# EAGLE design KGM IOExpander v1.1 (EAGLE 5.11)
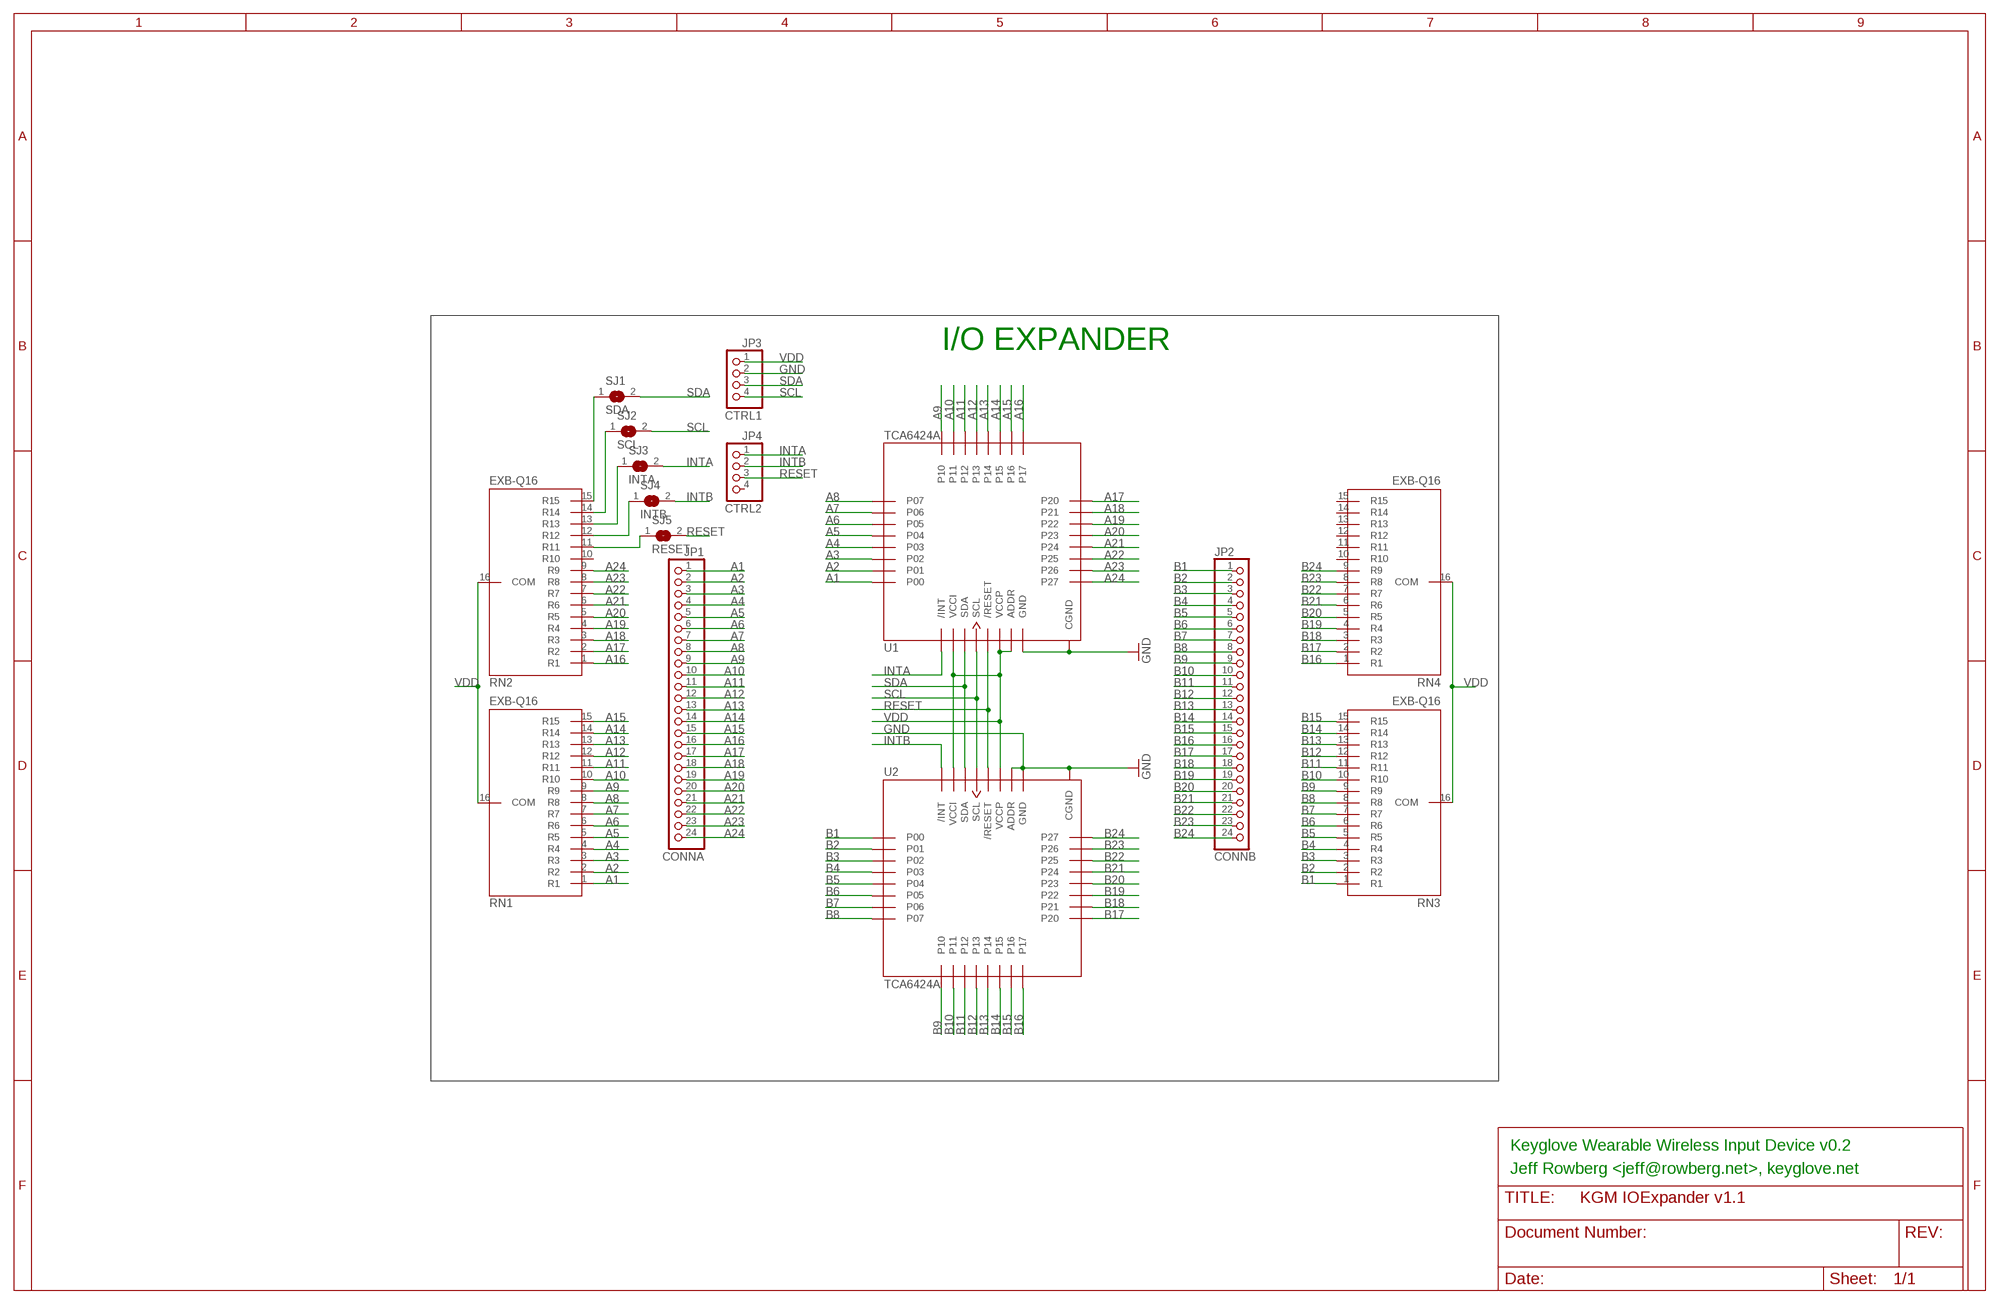
[diagram p0: schematic, sheet 1]

## Parts
JP1  CONNA  PINHD-1X24  [1X24]
JP2  CONNB  PINHD-1X24  [1X24]
JP3  CTRL1  PINHD-1X4  [1X04]
JP4  CTRL2  PINHD-1X4  [1X04]
RN1  EXB-Q16  [SMD1506]
RN2  EXB-Q16  [SMD1506]
RN3  EXB-Q16  [SMD1506]
RN4  EXB-Q16  [SMD1506]
SJ1  SDA  SJ  [SJ]
SJ2  SCL  SJ  [SJ]
SJ3  INTA  SJ  [SJ]
SJ4  INTB  SJ  [SJ]
SJ5  RESET  SJ  [SJ]
U1  TCA6424A  [QFN32]
U2  TCA6424A  [QFN32]

## Nets
A1: JP1.1 RN1.1(R1) U1.1(P00)
A2: JP1.2 RN1.2(R2) U1.2(P01)
A3: JP1.3 RN1.3(R3) U1.3(P02)
A4: JP1.4 RN1.4(R4) U1.4(P03)
A5: JP1.5 RN1.5(R5) U1.5(P04)
A6: JP1.6 RN1.6(R6) U1.6(P05)
A7: JP1.7 RN1.7(R7) U1.7(P06)
A8: JP1.8 RN1.8(R8) U1.8(P07)
A9: JP1.9 RN1.9(R9) U1.9(P10)
A10: JP1.10 RN1.10(R10) U1.10(P11)
A11: JP1.11 RN1.11(R11) U1.11(P12)
A12: JP1.12 RN1.12(R12) U1.12(P13)
A13: JP1.13 RN1.13(R13) U1.13(P14)
A14: JP1.14 RN1.14(R14) U1.14(P15)
A15: JP1.15 RN1.15(R15) U1.15(P16)
A16: JP1.16 RN2.1(R1) U1.16(P17)
A17: JP1.17 RN2.2(R2) U1.17(P20)
A18: JP1.18 RN2.3(R3) U1.18(P21)
A19: JP1.19 RN2.4(R4) U1.19(P22)
A20: JP1.20 RN2.5(R5) U1.20(P23)
A21: JP1.21 RN2.6(R6) U1.21(P24)
A22: JP1.22 RN2.7(R7) U1.22(P25)
A23: JP1.23 RN2.8(R8) U1.23(P26)
A24: JP1.24 RN2.9(R9) U1.24(P27)
B1: JP2.1 RN3.1(R1) U2.1(P00)
B2: JP2.2 RN3.2(R2) U2.2(P01)
B3: JP2.3 RN3.3(R3) U2.3(P02)
B4: JP2.4 RN3.4(R4) U2.4(P03)
B5: JP2.5 RN3.5(R5) U2.5(P04)
B6: JP2.6 RN3.6(R6) U2.6(P05)
B7: JP2.7 RN3.7(R7) U2.7(P06)
B8: JP2.8 RN3.8(R8) U2.8(P07)
B9: JP2.9 RN3.9(R9) U2.9(P10)
B10: JP2.10 RN3.10(R10) U2.10(P11)
B11: JP2.11 RN3.11(R11) U2.11(P12)
B12: JP2.12 RN3.12(R12) U2.12(P13)
B13: JP2.13 RN3.13(R13) U2.13(P14)
B14: JP2.14 RN3.14(R14) U2.14(P15)
B15: JP2.15 RN3.15(R15) U2.15(P16)
B16: JP2.16 RN4.1(R1) U2.16(P17)
B17: JP2.17 RN4.2(R2) U2.17(P20)
B18: JP2.18 RN4.3(R3) U2.18(P21)
B19: JP2.19 RN4.4(R4) U2.19(P22)
B20: JP2.20 RN4.5(R5) U2.20(P23)
B21: JP2.21 RN4.6(R6) U2.21(P24)
B22: JP2.22 RN4.7(R7) U2.22(P25)
B23: JP2.23 RN4.8(R8) U2.23(P26)
B24: JP2.24 RN4.9(R9) U2.24(P27)
GND [power]: JP3.2 U1.25(GND) U1.EP(CGND) U2.25(GND) U2.26(ADDR) U2.EP(CGND)
INTA: JP4.1 SJ3.2 U1.32(/INT)
INTB: JP4.2 SJ4.2 U2.32(/INT)
N$1: RN2.15(R15) SJ1.1
N$2: RN2.14(R14) SJ2.1
N$3: RN2.13(R13) SJ3.1
N$4: RN2.12(R12) SJ4.1
N$5: RN2.11(R11) SJ5.1
RESET: JP4.3 SJ5.2 U1.28(/RESET) U2.28(/RESET)
SCL: JP3.4 SJ2.2 U1.29(SCL) U2.29(SCL)
SDA: JP3.3 SJ1.2 U1.30(SDA) U2.30(SDA)
VDD [power]: JP3.1 RN1.16(COM) RN2.16(COM) RN3.16(COM) RN4.16(COM) U1.26(ADDR) U1.27(VCCP) U1.31(VCCI) U2.27(VCCP) U2.31(VCCI)
Unconnected: JP4.4 RN2.10(R10) RN4.10(R10) RN4.11(R11) RN4.12(R12) RN4.13(R13) RN4.14(R14) RN4.15(R15)

## Notes on the sheet
- I/O EXPANDER
- Keyglove Wearable Wireless Input Device v0.2
- Jeff Rowberg <jeff@rowberg.net>, keyglove.net

## Library data of the parts
JP1 JP2 = sf-pinhead:PINHD-1X24: PIN HEADER
JP3 JP4 = sf-pinhead:PINHD-1X4: PIN HEADER
RN1-RN4 = sf-keyglove:EXB-Q16
SJ1-SJ5 = jumper:SJ: SMD solder JUMPER
U1 U2 = sf-keyglove:TCA6424A

## Net classes
0 default: width 0.152 mm, drill 0.305 mm, clearance 0.152 mm
1 power: width 0.254 mm, drill 0.305 mm, clearance 0.152 mm

## Board
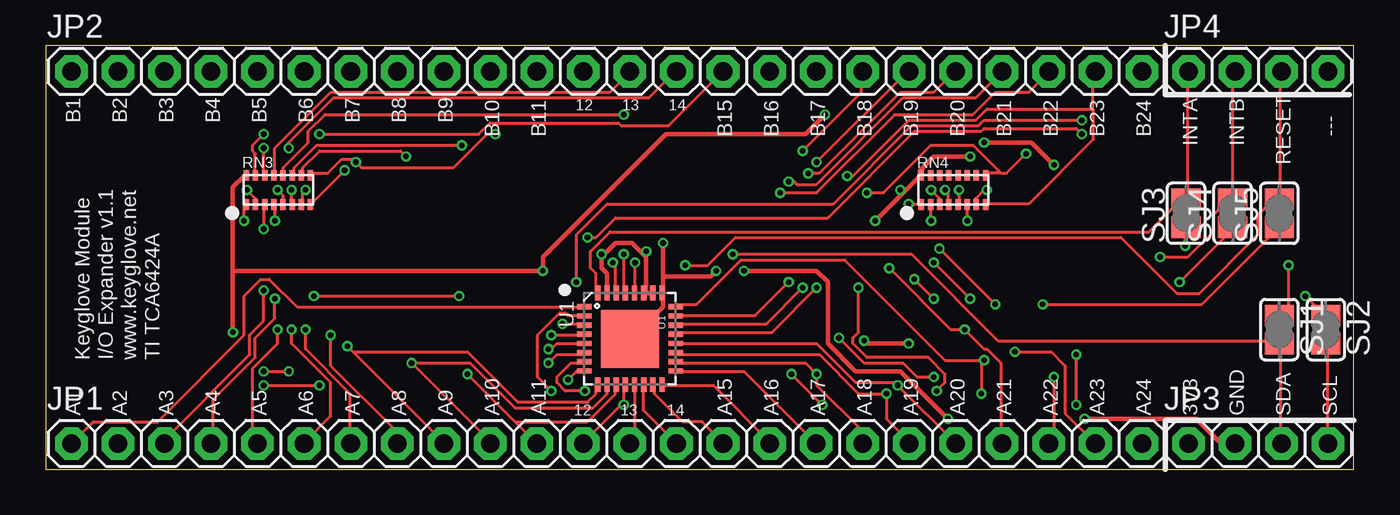
[diagram p1: board, top side]
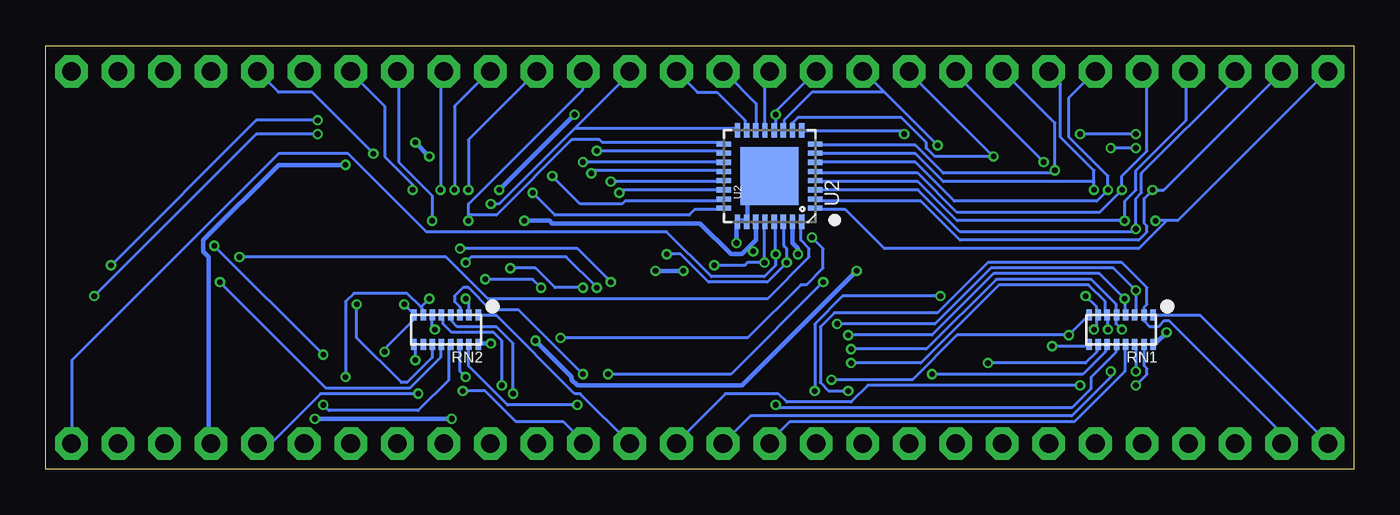
[diagram p2: board, bottom side, seen from below]

Size 71.37 x 23.11 mm. Coordinates in mm from the lower left corner, seen from the top.
Outline: 0,0 71.37,0 71.37,23.11 0,23.11 0,0
Copper layers (1*16): Top 0.0356mm / dielectric 1.5011mm / Bottom 0.0356mm
Design rules "PCBWingOrder *": minimum track width 6mil, minimum drill 12mil, track to track 6mil, track to pad 6mil, pad to pad 6mil, via to via 6mil, smd to smd 6mil, copper to edge 15mil, drill to drill 6mil, minimum pad ring 6mil, minimum via ring 5mil, stop-mask expansion 4mil, vias tented up to drill 20mil, thermal gap 10mil

### Footprints (pad centres in the part's own frame; a part is rotated, then mirrored left to right if it is on the bottom)
1X24 = drill 1.016 pad 1.778 octagon: 1 -29.21,0; 2 -26.67,0; 3 -24.13,0; 4 -21.59,0; 5 -19.05,0; 6 -16.51,0; 7 -13.97,0; 8 -11.43,0; 9 -8.89,0; 10 -6.35,0; 11 -3.81,0; 12 -1.27,0; 13 1.27,0; 14 3.81,0; 15 6.35,0; 16 8.89,0; 17 11.43,0; 18 13.97,0; 19 16.51,0; 20 19.05,0; 21 21.59,0; 22 24.13,0; 23 26.67,0; 24 29.21,0
1X04 = drill 1.016 pad 1.778 octagon: 1 -3.81,0; 2 -1.27,0; 3 1.27,0; 4 3.81,0
SMD1506 = smd 0.3 x 0.6: 1 -1.75,-0.8; 2 -1.25,-0.8; 3 -0.75,-0.8; 4 -0.25,-0.8; 5 0.25,-0.8; 6 0.75,-0.8; 7 1.25,-0.8; 8 1.75,-0.8; 9 1.75,0.8; 10 1.25,0.8; 11 0.75,0.8; 12 0.25,0.8; 13 -0.25,0.8; 14 -0.75,0.8; 15 -1.25,0.8; 16 -1.75,0.8
SJ = smd 1.168 x 1.6: 1 -0.762,0; 2 0.762,0
QFN32 = smd 0.285 x 0.8: 1 -1.75,-2.5; 2 -1.25,-2.5; 3 -0.75,-2.5; 4 -0.25,-2.5; 5 0.25,-2.5; 6 0.75,-2.5; 7 1.25,-2.5; 8 1.75,-2.5; 17 1.75,2.5; 18 1.25,2.5; 19 0.75,2.5; 20 0.25,2.5; 21 -0.25,2.5; 22 -0.75,2.5; 23 -1.25,2.5; 24 -1.75,2.5 | smd 0.8 x 0.285: 9 2.5,-1.75; 10 2.5,-1.25; 11 2.5,-0.75; 12 2.5,-0.25; 13 2.5,0.25; 14 2.5,0.75; 15 2.5,1.25; 16 2.5,1.75; 25 -2.5,1.75; 26 -2.5,1.25; 27 -2.5,0.75; 28 -2.5,0.25; 29 -2.5,-0.25; 30 -2.5,-0.75; 31 -2.5,-1.25; 32 -2.5,-1.75 | smd 3.15 x 3.15: EP 0,0

### Placement (x,y rotation side)
JP1  30.61,1.4 0 top
JP2  30.61,21.72 0 top
JP3  66.17,1.4 0 top
JP4  66.17,21.72 0 top
RN1  12.7,7.62 180 bottom
RN2  49.53,7.62 180 bottom
RN3  12.7,15.24 0 top
RN4  49.53,15.24 0 top
SJ1  67.31,7.62 270 top
SJ2  69.85,7.62 270 top
SJ3  62.23,13.97 90 top
SJ4  64.77,13.97 90 top
SJ5  67.31,13.97 90 top
U1  31.88,7.11 270 top
U2  31.88,16 90 bottom

### Tracks (layer width: path | path; a pad name or v marks a point on that pad's centre or on a via)
A1
  Top 0.152: U1.1 29.26,8.84 13.72,8.84 12.19,10.36 11.73,10.36 10.82,9.45 10.82,7.32 6.1,2.59 2.59,2.59 JP1.1
  Bottom 0.152: RN1.1 10.82,8.38 8.38,8.38 JP1.1
A2  (via drill 0.3)
  Top 0.152: v27.58,4.27 26.82,5.03 26.82,7.32 28.04,8.53 28.35,8.53 28.5,8.38 29.26,8.38 U1.2
  Bottom 0.152: JP1.2 3.96,1.52 3.96,1.98 10.06,8.08 10.36,8.08 10.67,7.77 11.12,7.77 11.43,8.08 11.43,8.38 RN1.2 11.43,8.53 11.43,8.84 11.28,8.99 11.28,9.91 12.65,11.28 19.96,11.28 22.71,8.53 28.35,8.53 29.11,7.77 29.11,4.72 28.65,4.27 v27.58,4.27
A3  (via drill 0.3)
  Top 0.152: v11.89,9.75 11.89,8.08 11.12,7.32 11.12,6.25 6.4,1.52 JP1.3 | v28.19,7.92 29.26,7.92 U1.3
  Bottom 0.152: RN1.3 11.89,8.53 v11.89,9.75 13.11,10.97 19.81,10.97 22.86,7.92 v28.19,7.92
A4  (via drill 0.3)
  Top 0.152: v12.5,9.3 12.5,8.23 11.43,7.16 11.43,6.1 9.14,3.81 9.14,1.52 JP1.4 | v27.58,7.32 29.26,7.32 U1.4
  Bottom 0.152: RN1.4 12.5,8.53 v12.5,9.3 13.87,10.67 19.66,10.67 23.01,7.32 v27.58,7.32
A5  (via drill 0.3)
  Top 0.152: v12.65,7.62 12.65,6.86 11.28,5.49 11.28,1.68 JP1.5 | v27.43,6.55 27.58,6.55 27.89,6.86 29.26,6.86 U1.5
  Bottom 0.152: v12.65,7.62 12.95,7.92 12.95,8.38 RN1.5 12.95,8.53 12.95,8.99 14.33,10.36 19.51,10.36 23.32,6.55 v27.43,6.55
A6  (via drill 0.3)
  Top 0.152: v13.41,7.62 13.41,6.86 15.54,4.72 15.54,2.9 14.17,1.52 JP1.6 | v27.43,5.79 27.89,6.25 29.26,6.25 U1.6
  Bottom 0.152: v13.41,7.62 13.41,8.38 RN1.6 13.56,8.53 13.56,9.14 14.48,10.06 19.36,10.06 23.62,5.79 v27.43,5.79
A7  (via drill 0.3)
  Top 0.152: v14.17,7.62 14.17,6.55 16.61,4.12 16.61,1.52 JP1.7 | v29.41,4.27 28.35,4.27 27.89,4.72 27.89,5.03 28.65,5.79 29.26,5.79 U1.7 | v14.63,9.45 v22.55,9.45
  Bottom 0.152: v14.17,7.62 14.02,7.77 14.02,8.38 RN1.7 14.02,8.53 14.02,8.84 v14.63,9.45 | v29.41,4.27 29.41,7.92 27.89,9.45 v22.55,9.45
A8  (via drill 0.3)
  Top 0.152: v15.54,7.32 15.54,5.64 19.05,2.13 19.05,1.52 JP1.8 | v28.5,4.88 28.96,5.33 29.26,5.33 U1.8
  Bottom 0.152: RN1.8 14.48,8.38 v15.54,7.32 21.64,7.32 24.08,4.88 v28.5,4.88
A9  (via drill 0.3)
  Top 0.152: 16.76,6.4 21.64,1.52 JP1.9 | v16.46,6.71 16.76,6.4 | 16.76,6.4 23.01,6.4 25.76,3.66 29.57,3.66 30.02,4.12 30.02,4.57 U1.9
  Bottom 0.152: v16.46,6.71 14.48,6.71 RN1.9
A10  (via drill 0.3)
  Top 0.152: JP1.10 24.23,1.52 v19.96,5.79 23.16,5.79 25.6,3.35 29.87,3.35 30.63,4.12 30.63,4.57 U1.10
  Bottom 0.152: v19.96,5.79 14.63,5.79 14.02,6.4 14.02,6.71 RN1.10
A11  (via drill 0.3)
  Top 0.152: v23.01,5.18 25.6,2.59 | 25.6,2.59 JP1.11 | 25.6,2.59 29.57,2.59 31.09,4.12 31.09,4.57 U1.11
  Bottom 0.152: v23.01,5.18 14.78,5.18 13.56,6.4 13.56,6.71 RN1.11
A12  (via drill 0.3)
  Top 0.152: 31.55,3.66 31.55,4.57 U1.12 | 31.55,3.66 29.41,1.52 JP1.12 | v31.55,3.5 31.55,3.66
  Bottom 0.152: v31.55,3.5 31.39,3.35 15.39,3.35 14.33,4.42 14.33,5.03 12.95,6.4 12.95,6.71 RN1.12
A13
  Top 0.152: U1.13 32.16,4.57 32.16,1.68 JP1.13
  Bottom 0.152: RN1.13 12.5,6.71 12.5,5.33 15.24,2.59 30.79,2.59 31.85,1.52 JP1.13
A14  (via drill 0.3)
  Top 0.152: v11.89,5.33 v13.26,5.33 | U1.14 32.61,4.57 32.61,3.2 JP1.14
  Bottom 0.152: v11.89,5.33 11.89,6.71 RN1.14 | v13.26,5.33 13.26,5.03 15.39,2.9 32.92,2.9 JP1.14
A15  (via drill 0.3)
  Top 0.152: v11.89,4.57 v14.94,4.57 | U1.15 33.22,4.57 33.22,4.12 34.75,2.59 35.81,2.59 36.88,1.52 JP1.15
  Bottom 0.152: v11.89,4.57 11.28,5.18 11.28,5.49 11.43,5.64 11.43,6.71 RN1.15 | v14.94,4.57 26.52,4.57 27.43,3.66 30.94,3.66 31.39,4.12 34.29,4.12 36.88,1.52 JP1.15
A16
  Top 0.152: U1.16 33.68,4.57 36.42,4.57 39.47,1.52 JP1.16
  Bottom 0.152: RN2.1 47.7,8.38 46.79,8.38 42.52,4.12 42.22,4.12 JP1.16
A17  (via drill 0.3)
  Top 0.152: v47.4,10.36 v48.46,9.3 | v44.35,9.91 44.35,7.47 44.04,7.16 44.04,6.86 44.81,6.1 48.16,6.1 49.07,5.18 49.07,4.72 v48.62,4.27 | U1.17 34.44,5.33 38.1,5.33 JP1.17
  Bottom 0.152: v48.46,9.3 48.31,9.14 48.31,8.53 RN2.2 | v47.4,10.36 44.81,10.36 v44.35,9.91 | v48.62,4.27 47.4,4.27 45.72,2.59 43.13,2.59 42.06,1.52 JP1.17
A18  (via drill 0.3)
  Top 0.152: JP1.18 44.5,1.52 44.5,2.13 42.06,4.57 v42.06,5.18 41.45,5.79 34.44,5.79 U1.18
  Bottom 0.152: v42.06,5.18 45.57,8.69 47.09,8.69 48.31,9.91 48.62,9.91 49.07,9.45 49.07,9.14 48.77,8.84 48.77,8.53 RN2.3
A19  (via drill 0.3)
  Top 0.152: JP1.19 47.09,1.52 45.87,2.74 v45.87,4.12 44.35,4.12 42.22,6.25 34.44,6.25 U1.19
  Bottom 0.152: v45.87,4.12 45.87,6.86 46.79,7.77 48.92,7.77 49.23,8.08 49.23,8.38 RN2.4
A20  (via drill 0.3)
  Top 0.152: JP1.20 v46.48,4.57 46.33,4.72 44.2,4.72 42.06,6.86 34.44,6.86 U1.20
  Bottom 0.152: v46.48,4.57 46.48,7.01 46.94,7.47 49.23,7.47 49.68,7.92 49.68,8.38 RN2.5
A21  (via drill 0.3)
  Top 0.152: JP1.21 52.12,1.52 52.12,5.79 51.36,6.55 51.21,6.55 v50.14,7.62 49.38,7.62 v46.02,10.97 | v42.06,9.91 39.62,7.47 34.44,7.47 U1.21
  Bottom 0.152: v50.14,7.62 50.29,7.77 50.29,8.38 RN2.6 | v42.06,9.91 43.59,9.91 44.65,10.97 v46.02,10.97
A22  (via drill 0.3)
  Top 0.152: v55.02,5.03 55.02,1.68 JP1.22 | v41.3,9.91 39.32,7.92 34.44,7.92 U1.22 | v48.46,11.28 v50.44,9.3
  Bottom 0.152: 50.9,8.84 51.66,9.6 54.56,9.6 55.02,9.14 v55.02,5.03 | 50.9,8.84 50.75,8.69 50.75,8.53 RN2.7 | v41.3,9.91 42.98,11.58 48.16,11.58 v48.46,11.28 | v50.44,9.3 50.9,8.84
A23  (via drill 0.3)
  Top 0.152: v52.88,6.4 54.86,6.4 55.63,5.64 55.63,3.05 JP1.23 | v40.54,10.21 38.71,8.38 34.44,8.38 U1.23 | v48.77,12.04 v51.82,8.99
  Bottom 0.152: v52.88,6.4 52.88,6.55 51.36,8.08 51.36,8.38 RN2.8 51.36,8.53 v51.82,8.99 | v40.54,10.21 42.37,12.04 v48.77,12.04
A24  (via drill 0.3)
  Top 0.152: 51.05,5.94 49.07,5.94 43.59,11.43 37.95,11.43 35.51,8.99 34.44,8.99 U1.24 | 51.05,5.94 v51.05,4.12 | 51.05,5.94 v51.21,5.94
  Bottom 0.152: v51.21,5.94 51.21,6.71 RN2.9 | v51.05,4.12 56.39,4.12 58.98,1.52 59.74,1.52 JP1.24
B1  (via drill 0.3)
  Top 0.152: v10.82,13.56 10.82,14.33 RN3.1
  Bottom 0.152: 10.21,13.56 9.6,13.56 1.52,21.64 JP2.1 | 10.21,13.56 v10.82,13.56 | 10.21,13.56 11.73,12.04 25.6,12.04 27.74,14.17 29.26,14.17 U2.1
B2  (via drill 0.3)
  Top 0.152: v10.97,15.24 11.43,14.78 11.43,14.48 RN3.2
  Bottom 0.152: JP2.2 3.96,21.64 10.36,15.24 v10.97,15.24 11.43,14.78 11.43,13.41 11.28,13.26 11.28,12.95 11.73,12.5 21.49,12.5 23.62,14.63 29.26,14.63 U2.2
B3  (via drill 0.3)
  Top 0.152: v11.89,13.11 11.89,14.33 RN3.3
  Bottom 0.152: JP2.3 6.55,21.64 6.55,21.18 11.58,16.15 11.58,15.09 11.89,14.78 v11.89,13.11 12.04,12.95 21.49,12.95 23.77,15.24 29.26,15.24 U2.3
B4  (via drill 0.3)
  Top 0.152: v12.5,13.56 12.5,14.33 RN3.4
  Bottom 0.152: JP2.4 9.14,21.64 9.14,19.05 11.89,16.31 11.89,15.24 12.5,14.63 v12.5,13.56 21.64,13.56 23.77,15.7 29.26,15.7 U2.4
B5  (via drill 0.3)
  Top 0.152: v12.65,15.24 12.95,14.94 12.95,14.48 RN3.5
  Bottom 0.152: JP2.5 11.43,21.64 11.28,21.49 11.28,17.37 12.65,16 v12.65,15.24 13.87,14.02 21.64,14.02 23.77,16.15 29.26,16.15 U2.5
B6  (via drill 0.3)
  Top 0.152: v13.41,15.24 13.41,14.48 RN3.6
  Bottom 0.152: JP2.6 15.54,20.27 15.54,18.14 13.41,16 v13.41,15.24 14.02,14.63 21.79,14.63 23.93,16.76 29.26,16.76 U2.6
B7  (via drill 0.3)
  Top 0.152: v14.17,15.24 14.02,15.09 14.02,14.48 RN3.7
  Bottom 0.152: 14.17,15.7 14.17,16.31 16,18.14 16,21.03 16.61,21.64 JP2.7 | v14.17,15.24 14.17,15.7 | 14.17,15.7 22.4,15.7 23.93,17.22 29.26,17.22 U2.7
B8  (via drill 0.3)
  Top 0.152: v16.31,16.31 14.48,14.48 RN3.8
  Bottom 0.152: JP2.8 19.05,21.64 16.31,18.9 v16.31,16.31 16.46,16.15 22.4,16.15 23.93,17.68 29.26,17.68 U2.8
B9  (via drill 0.3)
  Top 0.152: RN3.9 14.48,16.15 15.39,16.15 16.15,16.92 16.76,16.92 v16.92,16.76 17.22,16.46 22.25,16.46 24.08,18.29 v24.54,18.29
  Bottom 0.152: v16.92,16.76 21.79,21.64 JP2.9 | v24.54,18.29 24.69,18.44 30.02,18.44 U2.9
B10  (via drill 0.3)
  Top 0.152: v19.66,17.07 19.36,17.37 14.94,17.37 14.02,16.46 14.02,16.15 RN3.10
  Bottom 0.152: JP2.10 24.23,21.64 v19.66,17.07 22.86,17.07 23.32,17.53 23.32,17.83 24.69,19.2 30.33,19.2 30.63,18.9 30.63,18.59 U2.10
B11  (via drill 0.3)
  Top 0.152: v22.71,17.68 14.78,17.68 13.56,16.46 13.56,16.15 RN3.11
  Bottom 0.152: 25.6,20.57 26.67,21.64 JP2.11 | v22.71,17.68 25.6,20.57 | 25.6,20.57 29.57,20.57 31.09,19.05 31.09,18.59 U2.11
B12  (via drill 0.3)
  Top 0.152: v31.55,19.36 15.24,19.36 14.33,18.44 14.33,17.83 12.95,16.46 12.95,16.15 RN3.12
  Bottom 0.152: U2.12 31.55,18.59 v31.55,19.36 31.55,19.51 JP2.12
B13
  Top 0.152: RN3.13 12.5,16.15 12.5,17.53 15.54,20.57 30.79,20.57 31.85,21.64 JP2.13
  Bottom 0.152: U2.13 32.16,18.59 32.16,21.49 32,21.64 JP2.13
B14  (via drill 0.3)
  Top 0.152: v11.89,17.53 11.89,16.15 RN3.14 | v13.26,17.53 13.26,17.83 15.7,20.27 32.92,20.27 34.29,21.64 JP2.14
  Bottom 0.152: v11.89,17.53 v13.26,17.53 | U2.14 32.61,18.59 32.61,19.96 34.29,21.64 JP2.14
B15  (via drill 0.3)
  Top 0.152: v11.89,18.29 11.28,17.68 11.28,17.37 11.43,17.22 11.43,16.15 RN3.15 | v14.94,18.29 23.62,18.29 24.23,18.9 31.24,18.9 31.39,18.75 33.98,18.75 JP2.15
  Bottom 0.152: v11.89,18.29 v14.94,18.29 | U2.15 33.22,18.59 33.22,19.05 34.75,20.57 35.81,20.57 JP2.15
B16  (via drill 0.3)
  Top 0.152: v47.09,14.48 47.7,14.48 RN4.1
  Bottom 0.152: v47.09,14.48 46.63,14.48 42.52,18.59 | 42.52,18.59 39.47,21.64 JP2.16 | 42.52,18.59 33.68,18.59 U2.16
B17  (via drill 0.3)
  Top 0.152: v48.31,13.56 48.31,14.33 RN4.2
  Bottom 0.152: 48.31,13.87 48.31,14.48 42.06,20.73 42.06,21.64 JP2.17 | 48.31,13.87 v48.31,13.56 | 48.31,13.87 46.79,13.87 42.67,17.98 41.15,17.98 41,17.83 34.44,17.83 U2.17
B18  (via drill 0.3)
  Top 0.152: v48.31,15.24 48.77,14.78 48.77,14.48 RN4.3 | v41.3,17.37 44.5,20.57 44.5,21.64 JP2.18
  Bottom 0.152: v48.31,15.24 48.31,17.98 JP2.18 | v41.3,17.37 34.44,17.37 U2.18
B19  (via drill 0.3)
  Top 0.152: v49.07,15.24 49.23,15.09 49.23,14.48 RN4.4 | v42.06,16.76 47.09,21.79 JP2.19
  Bottom 0.152: v49.07,15.24 49.07,19.81 47.24,21.64 JP2.19 | v42.06,16.76 34.44,16.76 U2.19
B20  (via drill 0.3)
  Top 0.152: v49.84,15.24 49.84,14.48 RN4.5 | v41.6,16.15 42.22,16.15 46.63,20.57 48.46,20.57 49.53,21.64 JP2.20
  Bottom 0.152: v49.84,15.24 49.84,21.49 49.68,21.64 JP2.20 | v41.6,16.15 41.45,16.31 34.44,16.31 U2.20
B21  (via drill 0.3)
  Top 0.152: v50.29,13.56 50.29,14.33 RN4.6 | v40.54,15.7 40.84,15.7 41,15.54 42.06,15.54 46.79,20.27 50.75,20.27 JP2.21
  Bottom 0.152: v50.29,13.56 50.29,14.94 52.12,16.76 52.12,21.64 JP2.21 | v40.54,15.7 34.44,15.7 U2.21
B22  (via drill 0.3)
  Top 0.152: v51.36,15.24 51.21,15.24 50.75,14.78 50.75,14.48 RN4.7 | v40.08,15.09 42.06,15.09 46.33,19.36 50.6,19.36 51.82,20.57 53.65,20.57 54.71,21.64 JP2.22
  Bottom 0.152: v51.36,15.24 51.36,15.54 52.88,17.07 52.88,19.81 54.71,21.64 JP2.22 | v40.08,15.09 39.93,15.24 34.44,15.24 U2.22
B23  (via drill 0.3)
  Top 0.152: 57.15,19.66 57.15,21.64 JP2.23 | 57.15,19.66 57.15,17.98 53.65,14.48 51.36,14.48 RN4.8 | v43.74,16 44.04,16 47.09,19.05 50.75,19.05 51.36,19.66 57.15,19.66
  Bottom 0.152: v43.74,16 42.22,14.48 39.93,14.48 39.78,14.63 34.44,14.63 U2.23
B24  (via drill 0.3)
  Top 0.152: 52.12,16.15 52.43,16.15 v53.49,17.22 | 52.12,16.15 51.36,16.15 RN4.9 | v44.81,15.09 45.72,15.09 48.31,17.68 50.6,17.68 52.12,16.15
  Bottom 0.152: v53.49,17.22 56.84,20.57 58.67,20.57 JP2.24 | v44.81,15.09 43.59,13.87 36.27,13.87 35.97,14.17 34.44,14.17 U2.24
GND  (via drill 0.3)
  Top 0.254: U1.EP 32,7.16 33.68,8.84 33.68,9.6 U1.25 33.68,9.75 33.68,10.52 | 33.68,10.52 v33.68,12.34 | v56.69,2.74 62.79,2.74 64.01,1.52 64.77,1.52 JP3.2 | v49.23,2.74 46.63,5.33 44.2,5.33 42.67,6.86 42.67,10.21 42.06,10.82 v38.1,10.82 | v36.58,10.82 36.27,10.52 33.68,10.52
  Bottom 0.254: U2.EP 32,16 33.07,14.94 33.07,13.56 U2.26 33.22,13.56 33.53,13.56 U2.25 33.68,13.41 v33.68,12.34 | v49.23,2.74 v56.69,2.74 | v36.58,10.82 v38.1,10.82
INTA
  Top 0.152: U1.32 30.02,9.75 30.02,10.67 29.72,10.97 29.72,11.89 30.79,12.95 60.2,12.95 61.87,14.63 62.18,14.63 SJ3.2 62.33,14.78 62.33,21.64 JP4.1
INTB  (via drill 0.3)
  Top 0.152: v60.81,11.58 62.33,11.58 63.7,12.95 63.7,13.87 64.47,14.63 64.77,14.63 SJ4.2 64.77,21.64 JP4.2
  Bottom 0.152: v60.81,11.58 49.53,11.58 47.24,9.3 32,9.3 29.72,11.58 29.72,12.04 30.18,12.5 30.18,13.41 U2.32
N$1  (via drill 0.3)
  Top 0.152: v40.69,5.18 v42.37,3.5 | v28.96,10.21 28.96,12.8 30.63,14.48 42.98,14.48 47.24,18.75 50.9,18.75 51.21,19.05 v56.54,19.05 | v67.82,11.12 67.82,8.84 67.36,8.38 SJ1.1
  Bottom 0.152: v42.37,3.5 46.18,3.5 48.31,5.64 48.31,6.71 RN2.15 | v40.69,5.18 33.98,5.18 v28.96,10.21 | v56.54,19.05 59.89,19.05 v67.82,11.12
N$2  (via drill 0.3)
  Top 0.152: v48.46,5.03 47.55,5.03 46.79,5.79 44.65,5.79 v43.28,7.16 | v29.57,12.65 30.02,12.65 31.09,13.72 42.67,13.72 47.4,18.44 51.05,18.44 51.21,18.59 56.24,18.59 v56.54,18.29 | v68.73,9.45 69.8,8.38 SJ2.1
  Bottom 0.152: v48.46,5.03 48.77,5.33 48.77,6.71 RN2.14 | v43.28,7.16 33.07,7.16 30.18,10.06 29.87,10.06 28.96,10.97 28.96,12.04 v29.57,12.65 | v56.54,18.29 59.89,18.29 v68.73,9.45
N$3  (via drill 0.3)
  Top 0.152: v56.24,3.5 v56.24,6.25 | v62.18,12.19 62.18,13.11 SJ3.1
  Bottom 0.152: v56.24,3.5 55.93,3.2 51.05,3.2 49.38,4.88 49.38,6.71 RN2.13 | v56.24,6.25 v62.18,12.19
N$4  (via drill 0.3)
  Top 0.152: v61.87,10.21 64.77,13.11 SJ4.1
  Bottom 0.152: v61.87,10.21 56.08,4.42 51.51,4.42 49.84,6.1 49.84,6.71 RN2.12
N$5  (via drill 0.3)
  Top 0.152: v54.41,8.99 63.09,8.99 SJ5.1
  Bottom 0.152: v54.41,8.99 54.41,7.16 51.97,4.72 51.66,4.72 50.29,6.1 50.29,6.71 RN2.11
RESET  (via drill 0.3)
  Top 0.152: v32.16,11.28 32.16,9.75 U1.28 | 67.36,15.09 67.36,21.64 JP4.3 | 67.36,15.09 67.36,14.78 SJ5.2 67.36,15.09 | v34.9,11.12 36.12,11.12 37.64,12.65 58.67,12.65 61.72,9.6 62.94,9.6 66.14,12.8 66.14,13.87 67.36,15.09
  Bottom 0.152: U2.28 32.16,13.41 v32.16,11.28 33.07,11.28 33.22,11.12 v34.9,11.12
SCL  (via drill 0.3)
  Top 0.152: v31.55,11.73 31.55,9.75 U1.29 | SJ2.2 69.95,6.86 69.95,1.52 JP3.4
  Bottom 0.152: U2.29 31.55,13.41 v31.55,11.73 31.55,11.12 32.16,10.52 35.05,10.52 37.49,12.95 50.6,12.95 54.86,17.22 58.67,17.22 69.95,5.94 69.95,1.52 JP3.4
SDA  (via drill 0.3)
  Top 0.152: v30.94,11.28 31.09,11.12 31.09,9.75 U1.30 | JP3.3 67.36,1.52 67.36,6.86 SJ1.2 67.21,6.86 67.06,7.01 51.97,7.01 47.24,11.73 v37.49,11.73
  Bottom 0.152: U2.30 31.09,13.41 31.09,12.19 30.94,12.04 v30.94,11.28 32,10.21 35.2,10.21 36.73,11.73 v37.49,11.73
VDD  (via drill 0.3)
  Top 0.254: 10.21,10.82 10.21,15.39 10.82,16 RN3.16 | v10.21,7.47 10.21,10.82 | v47.09,6.86 44.81,6.86 v44.65,7.01 | 10.21,10.82 v27.13,10.82 27.13,11.58 33.83,18.29 41.45,18.29 v42.52,19.36 | 30.4,11.66 31.09,12.34 32,12.34 32.54,11.81 | 30.4,11.66 30.33,11.58 30.33,10.97 30.63,10.67 30.63,9.75 U1.31 | 32.54,11.81 32.77,11.58 32.77,9.75 U1.27 32.77,9.6 33.07,9.6 U1.26 | 30.4,11.66 v30.33,11.73 | 46.86,15.16 v45.26,13.56 | 46.86,15.16 47.7,16 RN4.16 47.7,16.15 47.7,16.31 48.46,17.07 v50.44,17.07 | v32.77,11.89 32.61,11.89 32.54,11.81 | v55.02,16.61 53.8,17.83 v51.21,17.83 | v46.63,15.24 46.79,15.24 46.86,15.16
  Bottom 0.254: v10.21,7.47 10.82,6.86 RN1.16 | v47.09,6.86 47.7,6.86 RN2.16 | v44.65,7.01 42.67,5.03 42.67,4.88 42.37,4.57 33.38,4.57 v27.13,10.82 | v30.33,11.73 30.33,12.04 30.63,12.34 30.63,13.41 U2.31 | v45.26,13.56 43.89,13.56 43.74,13.41 35.66,13.41 33.98,11.73 33.38,11.73 32.99,12.12 | 32.99,12.12 32.61,12.5 32.61,13.41 U2.27 | 32.99,12.12 v32.77,11.89 | v55.02,16.61 58.67,16.61 62.79,12.5 62.79,11.89 62.48,11.58 62.48,1.52 JP3.1 | v50.44,17.07 v51.21,17.83 | v42.52,19.36 v46.63,15.24

### Text on the board
tPlace: 12 | 13 | 14 | B1 | B2 | B3 | B4 | B5 | B6 | B7 | B8 | B9 | B10 | B11 | B15 | B16 | B17 | B18 | B19 | B20 | B21 | B22 | B23 | B24 | INTA | INTB | --- | RESET | U1 | Keyglove Module | I/O Expander v1.1 | www.keyglove.net | TI TCA6424A | A1 | A2 | A3 | A4 | A5 | A6 | A7 | A8 | A9 | A10 | A11 | 12 | 13 | 14 | A15 | A16 | A17 | A18 | A19 | A20 | A21 | A22 | A23 | A24 | 3V3 | GND | SDA | SCL
bPlace: U2